# EAGLE schematic Schematic (EAGLE 9.6.0)
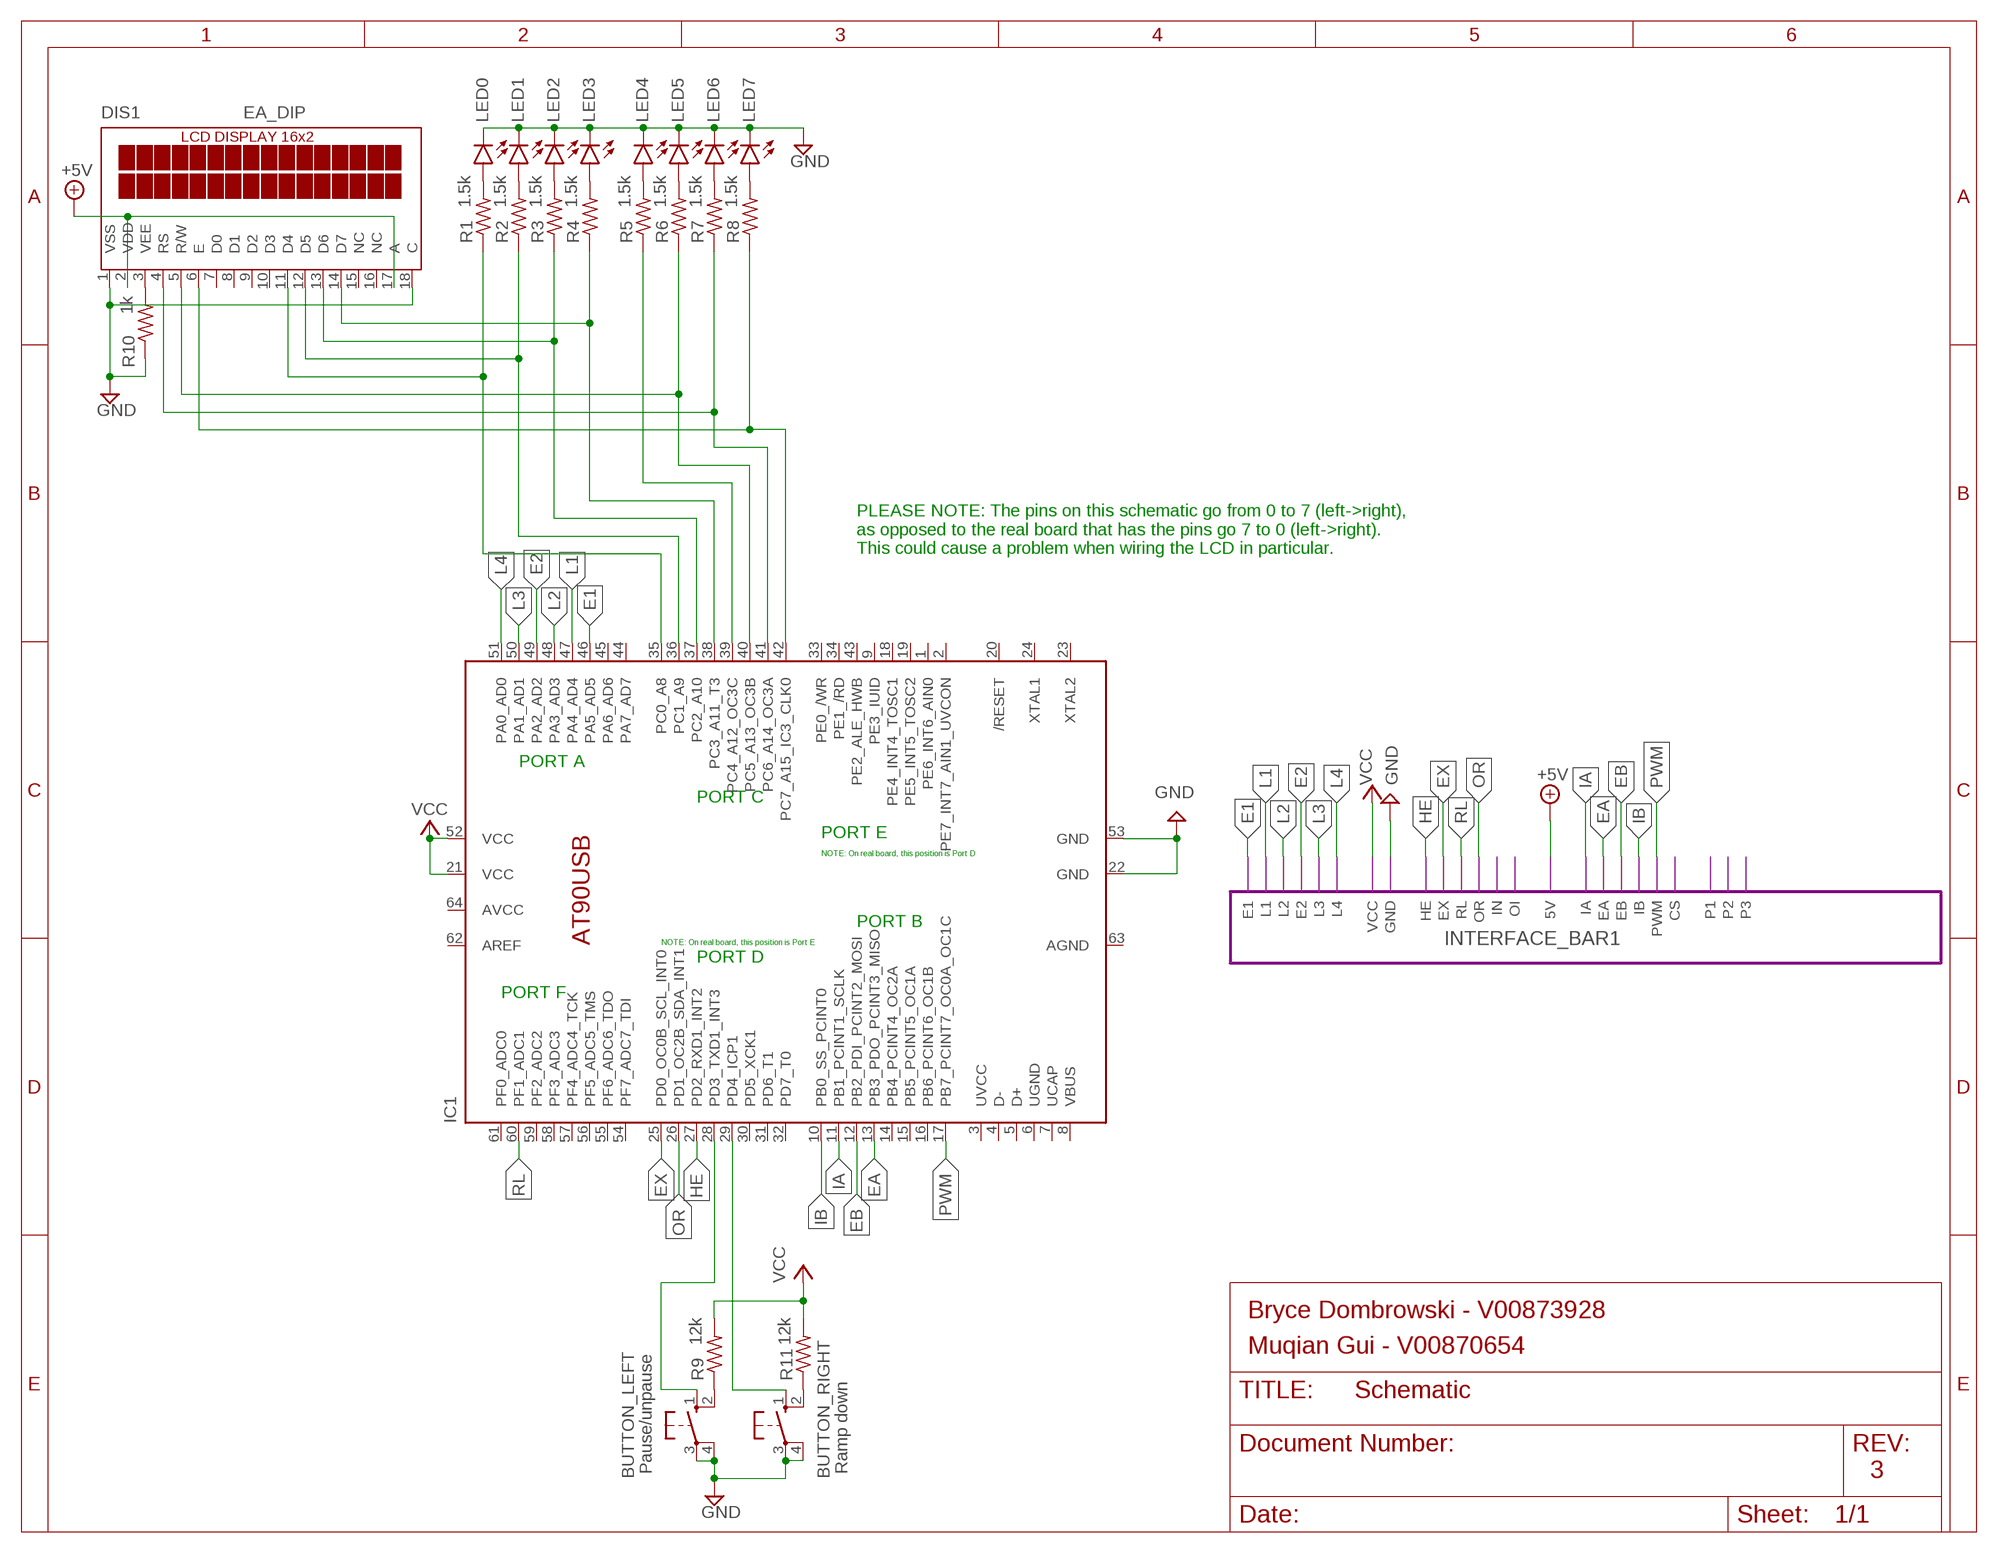
[diagram p0: schematic, sheet 1]

## Parts
BUTTON_LEFT  Pause/unpause  10-XX  [B3F-10XX]
BUTTON_RIGHT  Ramp down  10-XX  [B3F-10XX]
DIS1  EA_DIP  [EA_DIP]
IC1  AT90USB-QFN  [QFN64]
LED0  LED3MM  [LED3MM]
LED1  LED3MM  [LED3MM]
LED2  LED3MM  [LED3MM]
LED3  LED3MM  [LED3MM]
LED4  LED3MM  [LED3MM]
LED5  LED3MM  [LED3MM]
LED6  LED3MM  [LED3MM]
LED7  LED3MM  [LED3MM]
R1  1.5k  R-US_0204/7  [0204/7]
R2  1.5k  R-US_0204/7  [0204/7]
R3  1.5k  R-US_0204/7  [0204/7]
R4  1.5k  R-US_0204/7  [0204/7]
R5  1.5k  R-US_0204/7  [0204/7]
R6  1.5k  R-US_0204/7  [0204/7]
R7  1.5k  R-US_0204/7  [0204/7]
R8  1.5k  R-US_0204/7  [0204/7]
R9  12k  R-US_0204/7  [0204/7]
R10  1k  R-US_0204/7  [0204/7]
R11  12k  R-US_0204/7  [0204/7]

## Module instances
INTERFACE_BAR1 = INTERFACE_BAR

## Nets
+5V: DIS1.2(VDD) DIS1.17(A) ; port INTERFACE_BAR1.5V
E1: IC1.46(PA5_AD5) ; port INTERFACE_BAR1.E1
E2: IC1.49(PA2_AD2) ; port INTERFACE_BAR1.E2
EA: IC1.13(PB3_PDO_PCINT3_MISO) ; port INTERFACE_BAR1.EA
EB: IC1.12(PB2_PDI_PCINT2_MOSI) ; port INTERFACE_BAR1.EB
EX: IC1.25(PD0_OC0B_SCL_INT0) ; port INTERFACE_BAR1.EX
GND: BUTTON_LEFT.3(P) BUTTON_LEFT.4(P1) BUTTON_RIGHT.3(P) BUTTON_RIGHT.4(P1) DIS1.1(VSS) DIS1.18(C) IC1.22(GND) IC1.53(GND) LED0.K(C) LED1.K(C) LED2.K(C) LED3.K(C) LED4.K(C) LED5.K(C) LED6.K(C) LED7.K(C) R10.1 ; port INTERFACE_BAR1.GND
HE: IC1.27(PD2_RXD1_INT2) ; port INTERFACE_BAR1.HE
IA: IC1.11(PB1_PCINT1_SCLK) ; port INTERFACE_BAR1.IA
IB: IC1.10(PB0_SS_PCINT0) ; port INTERFACE_BAR1.IB
L1: IC1.47(PA4_AD4) ; port INTERFACE_BAR1.L1
L2: IC1.48(PA3_AD3) ; port INTERFACE_BAR1.L2
L3: IC1.50(PA1_AD1) ; port INTERFACE_BAR1.L3
L4: IC1.51(PA0_AD0) ; port INTERFACE_BAR1.L4
N$1: DIS1.11(D4) IC1.35(PC0_A8) R1.1
N$2: DIS1.12(D5) IC1.36(PC1_A9) R2.1
N$3: DIS1.13(D6) IC1.37(PC2_A10) R3.1
N$4: DIS1.14(D7) IC1.38(PC3_A11_T3) R4.1
N$5: IC1.39(PC4_A12_OC3C) R5.1
N$6: DIS1.5(R/W) IC1.40(PC5_A13_OC3B) R6.1
N$7: DIS1.4(RS) IC1.41(PC6_A14_OC3A) R7.1
N$8: DIS1.6(E) IC1.42(PC7_A15_IC3_CLK0) R8.1
N$9: LED0.A R1.2
N$10: LED1.A R2.2
N$11: LED2.A R3.2
N$12: LED3.A R4.2
N$13: LED4.A R5.2
N$14: LED5.A R6.2
N$15: LED6.A R7.2
N$16: LED7.A R8.2
N$17: DIS1.3(VEE) R10.2
N$18: BUTTON_LEFT.2(S1) R9.1
N$19: BUTTON_RIGHT.2(S1) R11.1
N$22: BUTTON_RIGHT.1(S) IC1.29(PD4_ICP1)
N$24: BUTTON_LEFT.1(S) IC1.28(PD3_TXD1_INT3)
OR: IC1.26(PD1_OC2B_SDA_INT1) ; port INTERFACE_BAR1.OR
PWM: IC1.17(PB7_PCINT7_OC0A_OC1C) ; port INTERFACE_BAR1.PWM
RL: IC1.60(PF1_ADC1) ; port INTERFACE_BAR1.RL
VCC: IC1.21(VCC) IC1.52(VCC) R9.2 R11.2 ; port INTERFACE_BAR1.VCC
Unconnected: DIS1.7(D0) DIS1.8(D1) DIS1.9(D2) DIS1.10(D3) DIS1.15(NC) DIS1.16(NC) IC1.1(PE6_INT6_AIN0) IC1.2(PE7_INT7_AIN1_UVCON) IC1.4(D-) IC1.5(D+) IC1.8(VBUS) IC1.9(PE3_IUID) IC1.14(PB4_PCINT4_OC2A) IC1.15(PB5_PCINT5_OC1A) IC1.16(PB6_PCINT6_OC1B) IC1.18(PE4_INT4_TOSC1) IC1.19(PE5_INT5_TOSC2) IC1.20(/RESET) IC1.23(XTAL2) IC1.24(XTAL1) IC1.30(PD5_XCK1) IC1.31(PD6_T1) IC1.32(PD7_T0) IC1.33(PE0_/WR) IC1.34(PE1_/RD) IC1.43(PE2_ALE_HWB) IC1.44(PA7_AD7) IC1.45(PA6_AD6) IC1.54(PF7_ADC7_TDI) IC1.55(PF6_ADC6_TDO) IC1.56(PF5_ADC5_TMS) IC1.57(PF4_ADC4_TCK) IC1.58(PF3_ADC3) IC1.59(PF2_ADC2) IC1.61(PF0_ADC0)

## Notes on the sheet
- PLEASE NOTE: The pins on this schematic go from 0 to 7 (left->right),
  as opposed to the real board that has the pins go 7 to 0 (left->right).
  This could cause a problem when wiring the LCD in particular.
- PORT A
- PORT C
- PORT E
- NOTE: On real board, this position is Port D
- PORT B
- NOTE: On real board, this position is Port E
- PORT D
- PORT F
- Bryce Dombrowski - V00873928
- Muqian Gui - V00870654
- 3

## Power pins joined to a net without a drawn wire
AGND: IC1.63(AGND)
AREF: IC1.62(AREF)
AVCC: IC1.64(AVCC)
UCAP: IC1.7(UCAP)
UGND: IC1.6(UGND)
UVCC: IC1.3(UVCC)

## Library data of the parts
BUTTON_LEFT BUTTON_RIGHT = switch-omron:10-XX: OMRON SWITCH; MPN: B3F-1000; OC_FARNELL: 176432; OC_NEWARK: 36M3542
DIS1 = display-lcd:EA_DIP: LCD-MODUL 2x16 - 6,68mm, INKL. KONTROLLER HD44780 Source: Data sheet <http://www.lcd-module.de/pdf/doma/dip162-d.pdf>
IC1 = controller-micro_atmel_jd:AT90USB
LED0 LED1-LED7 = led:LED: LED OSRAM: - CHIPLED LG R971, LG N971, LY N971, LG Q971, LY Q971, LO R971, LY R971 LH N974, LH R974 LS Q976, LO Q976, LY Q976 LO Q996 - Hyper CHIPLED LW Q18S LB Q993, LB Q99A, LB R99A - SideLED LS A670, LO A670, LY A670, LG A670, LP A670 LB A673, LV A673, LT A673, LW A673 LH A674 LY A675 LS A676, LA A676, LO A676, LY A676, LW A676 LS A679, LY A679, LG A679 - Hyper Micro SIDELED® LS Y876, LA Y876, LO Y876, LY Y876 LT Y87S - SmartLED LW L88C, LW L88S LB L89C, LB L89S, LG L890 LS L89K, LO L89K, LY L89K LS L896, LA L896, LO L896, LY L896 - TOPLED LS T670, LO T670, LY T670, LG T670, LP T670 LSG T670, LSP T670, LSY T670, LOP T670, LYG T670 LG T671, LOG T671, LSG T671 LB T673, LV T673, LT T673, LW T673 LH T674 LS T676, LA T676, LO T676, LY T676, LB T676, LH T676, LSB T676, LW T676 LB T67C, LV T67C, LT T67C, LS T67K, LO T67K, LY T67K, LW E67C LS E67B, LA E67B, LO E67B, LY E67B, LB E67C, LV E67C, LT E67C LW T67C LS T679, LY T679, LG T679 LS T770, LO T770, LY T770, LG T770, LP T770 LB T773, LV T773, LT T773, LW T773 LH T774 LS E675, LA E675, LY E675, LS T675 LS T776, LA T776, LO T776, LY T776, LB T776 LHGB T686 LT T68C, LB T68C - Hyper Mini TOPLED® LB M676 - Mini TOPLED Santana® LG M470 LS M47K, LO M47K, LY M47K Source: http://www.osram.convergy.de LUXEON: - LUMILED® LXK2-PW12-R00, LXK2-PW12-S00, LXK2-PW14-U00, LXK2-PW14-V00 LXK2-PM12-R00, LXK2-PM12-S00, LXK2-PM14-U00 LXK2-PE12-Q00, LXK2-PE12-R00, LXK2-PE12-S00, LXK2-PE14-T00, LXK2-PE14-U00 LXK2-PB12-K00, LXK2-PB12-L00, LXK2-PB12-M00, LXK2-PB14-N00, LXK2-PB14-P00, LXK2-PB14-Q00 LXK2-PR12-L00, LXK2-PR12-M00, LXK2-PR14-Q00, LXK2-PR14-R00 LXK2-PD12-Q00, LXK2-PD12-R00, LXK2-PD12-S00 LXK2-PH12-R00, LXK2-PH12-S00 LXK2-PL12-P00, LXK2-PL12-Q00, LXK2-PL12-R00 Source: www.luxeon.com KINGBRIGHT: KA-3528ASYC Source: www.kingbright.com
R1-R11 = rcl:R-US_: RESISTOR, American symbol; SPICEPREFIX: R

## Module AT90USB1287
Ports: A7(io) A6(io) A5(io) A4(io) A3(io) A2(io) A1(io) A0(io) C7(io) C6(io) C5(io) C4(io) C3(io) C2(io) C1(io) C0(io)

### Library data of the parts

## Module INTERFACE_BAR
Ports: E1(io) L1(io) L2(io) E2(io) L3(io) L4(io) VCC(io) GND(io) HE(io) EX(io) RL(io) OR(io) IN(io) OI(io) 5V(io) IA(io) EA(io) EB(io) IB(io) PWM(io) CS(io) P1(io) P2(io) P3(io)

### Library data of the parts